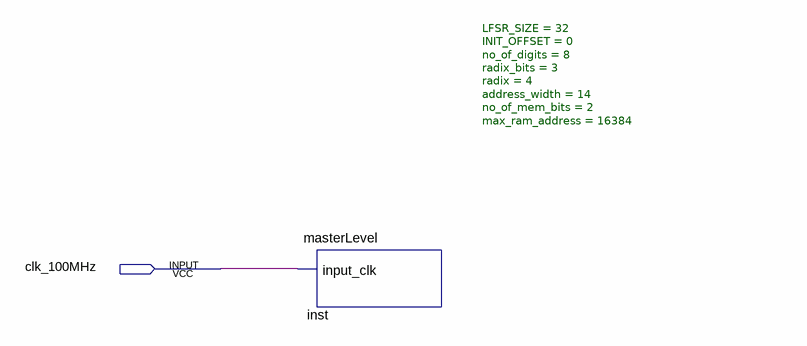
[diagram p0: schematic sheet]
// Quartus schematic top_trial.bdf as structural Verilog: 1 symbols, 1 pins
module top_trial (
  input  clk_100MHz
);

  masterLevel #(.LFSR_SIZE(32), .INIT_OFFSET(0), .no_of_digits(8), .radix_bits(3), .radix(4), .address_width(14), .no_of_mem_bits(2), .max_ram_address(16384)) inst (.input_clk(clk_100MHz));
endmodule
